# Altium schematic sheet balancing_protection.SchDoc
size A4; PageSetup: Record=PageOptions|CenterHorizontal=True|CenterVertical=True|PrintScale=1.00|XCorrection=1.00|YCorrection=1.00|PrintKind=0|BorderSize=5000000|LeftOffset=0|BottomOffset=0|Orientation=2|PaperLength=1000|PaperWidth=1000|Scale=100|PaperSource=7|PrintQuality=-4|MediaType=1|DitherType=10|PaperKind=A4|PrintScaleMode=1
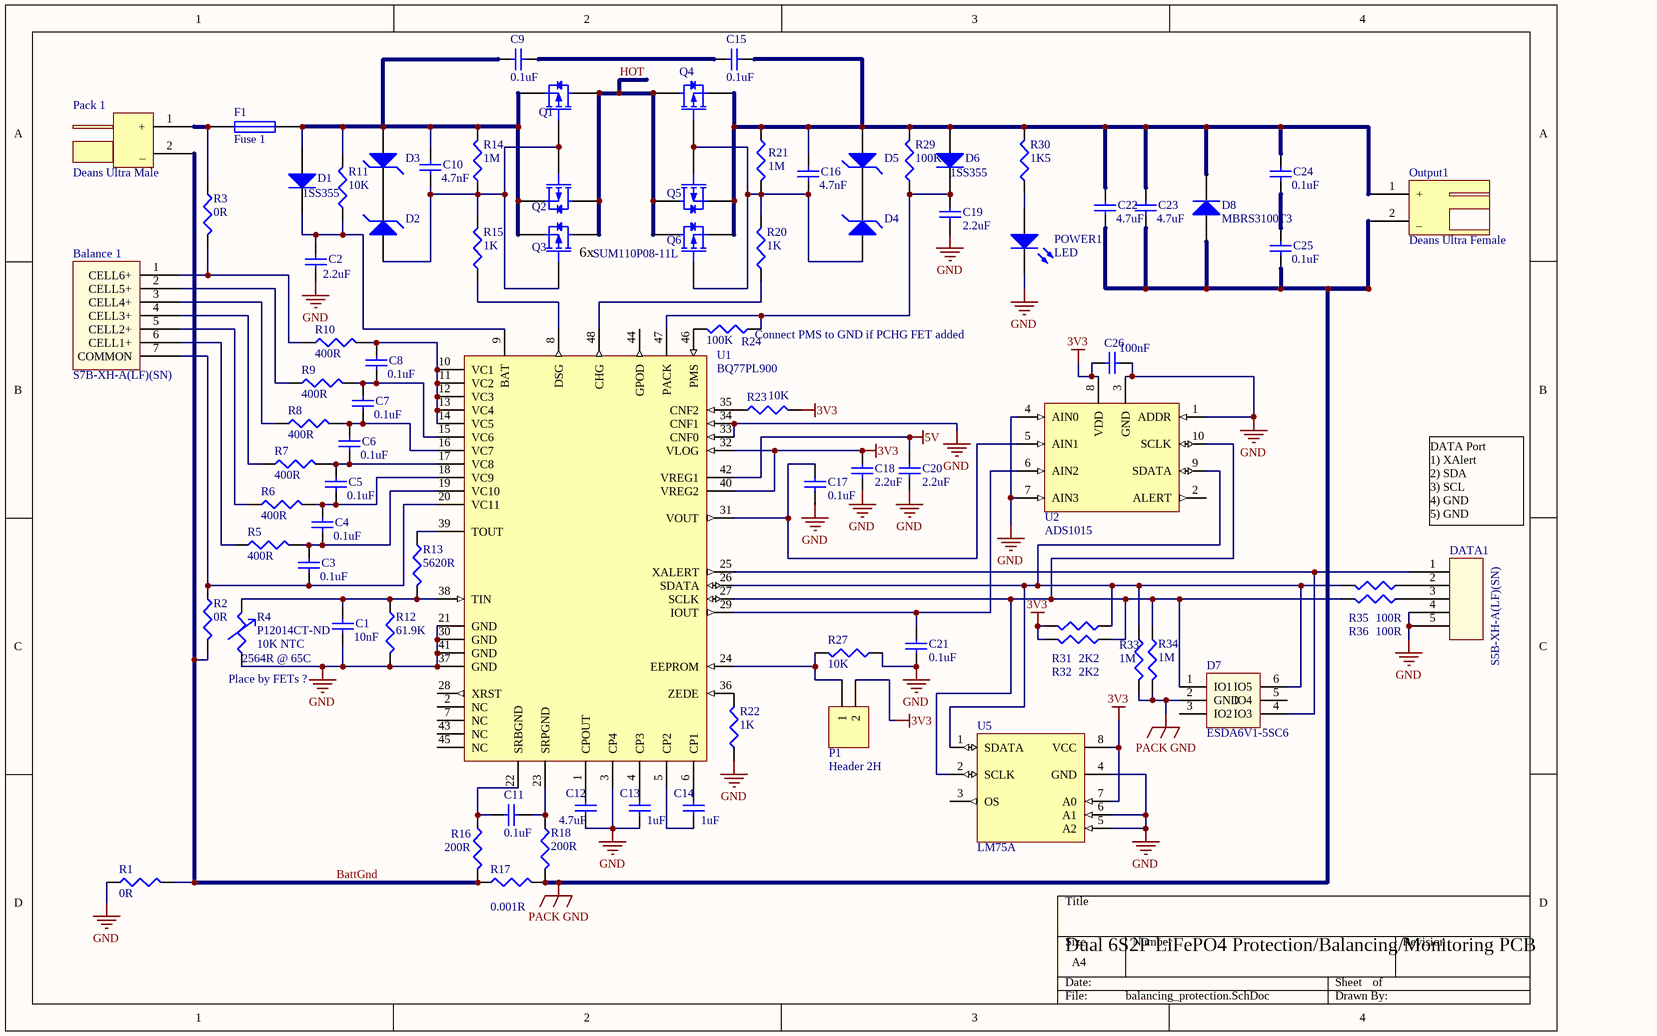
[diagram p0: balancing_protection.SchDoc]

## Parts
Balance_1  S7B-XH-A(LF)(SN)  [XH_BALANCE_CONN]
C1  value 10nF  [0603 - Hugo copy]  (hidden comment: Cap Semi)
C2  value 2.2uF  [CAPC1206X06N]  (hidden comment: 718-1113-1-ND)
C3  value 0.1uF  [0603 - Hugo copy]  (hidden comment: Cap Semi)
C4  value 0.1uF  [0603 - Hugo copy]  (hidden comment: Cap Semi)
C5  value 0.1uF  [0603 - Hugo copy]  (hidden comment: Cap Semi)
C6  value 0.1uF  [0603 - Hugo copy]  (hidden comment: Cap Semi)
C7  value 0.1uF  [0603 - Hugo copy]  (hidden comment: Cap Semi)
C8  value 0.1uF  [0603 - Hugo copy]  (hidden comment: Cap Semi)
C9  value 0.1uF  [0603 - Hugo copy]  (hidden comment: Cap Semi)
C10  value 4.7nF  [0603 - Hugo copy]  (hidden comment: Cap Semi)
C11  value 0.1uF  [0603 - Hugo copy]  (hidden comment: Cap Semi)
C12  value 4.7uF  [CAPC1210X10N]  (hidden comment: 718-1113-1-ND)
C13  value 1uF  [CAPC1206X06N]  (hidden comment: 718-1113-1-ND)
C14  value 1uF  [CAPC1206X06N]  (hidden comment: 718-1113-1-ND)
C15  value 0.1uF  [0603 - Hugo copy]  (hidden comment: Cap Semi)
C16  value 4.7nF  [0603 - Hugo copy]  (hidden comment: Cap Semi)
C17  value 0.1uF  [0603 - Hugo copy]  (hidden comment: 718-1113-1-ND)
C18  value 2.2uF  [0603 - Hugo copy]  (hidden comment: 718-1113-1-ND)
C19  value 2.2uF  [CAPC1206X06N]  (hidden comment: 718-1113-1-ND)
C20  value 2.2uF  [0603 - Hugo copy]  (hidden comment: 718-1113-1-ND)
C21  value 0.1uF  [0603 - Hugo copy]  (hidden comment: 718-1113-1-ND)
C22  value 4.7uF  [CAPC3216L]  (hidden comment: Cap Semi)
C23  value 4.7uF  [CAPC3216L]  (hidden comment: Cap Semi)
C24  value 0.1uF  [0603 - Hugo copy]  (hidden comment: Cap Semi)
C25  value 0.1uF  [0603 - Hugo copy]  (hidden comment: Cap Semi)
C26  value 100nF  [0603 - Hugo copy]  (hidden comment: Cap Semi)
D1  1SS355  [SOD323-rough]
D2  BZX585-C16  [SOD523-rough]  (value not drawn)
D3  BZX585-C16  [SOD523-rough]  (value not drawn)
D4  BZX585-C16  [SOD523-rough]  (value not drawn)
D5  BZX585-C16  [SOD523-rough]  (value not drawn)
D6  1SS355  [SOD323-rough]
D7  ESDA6V1-5SC6  [SOT23-6]
D8  MBRS3100T3  [SOJ300P790X241-2M-SMC Case 403]
DATA1  S5B-XH-A(LF)(SN)  [XH_I2C_CONN]
F1  Fuse 1  [FUSE outline]
Output1  Deans Ultra Female  [DEANS_FEMALE_SIDEWAYS - n]
P1  Header 2H  [HDR1X2H]
Pack_1  Deans Ultra Male  [DEANS_MALE_SIDEWAYS - n]
POWER1  LED  [LED0805]
Q1  SUM110P08-11L  [D2PAK]
Q2  SUM110P08-11L  [D2PAK]  (value not drawn)
Q3  SUM110P08-11L  [D2PAK]  (value not drawn)
Q4  SUM110P08-11L  [D2PAK]  (value not drawn)
Q5  SUM110P08-11L  [D2PAK]  (value not drawn)
Q6  SUM110P08-11L  [D2PAK]  (value not drawn)
R1  value 0R  [0603 - Hugo copy]  (hidden comment: 541-17.8ACCT-ND)
R2  value 0R  [0603 - Hugo Copy]  (hidden comment: 541-17.8ACCT-ND)
R3  value 0R  [0603 - Hugo Copy]  (hidden comment: 541-17.8ACCT-ND)
R4  P12014CT-ND  value 10K NTC  [0603 - Hugo copy]
R5  value 400R  [0603 - HUGO COPY]  (hidden comment: 541-17.8ACCT-ND)
R6  value 400R  [0603 - HUGO COPY]  (hidden comment: 541-17.8ACCT-ND)
R7  value 400R  [0603 - HUGO COPY]  (hidden comment: 541-17.8ACCT-ND)
R8  value 400R  [0603 - HUGO COPY]  (hidden comment: 541-17.8ACCT-ND)
R9  value 400R  [0603 - HUGO COPY]  (hidden comment: 541-17.8ACCT-ND)
R10  value 400R  [0603 - HUGO COPY]  (hidden comment: 541-17.8ACCT-ND)
R11  value 10K  [0603 - HUGO COPY]  (hidden comment: 541-17.8ACCT-ND)
R12  value 61.9K  [0603 - HUGO COPY]  (hidden comment: 541-17.8ACCT-ND)
R13  value 5620R  [0603 - HUGO COPY]  (hidden comment: 541-17.8ACCT-ND)
R14  value 1M  [0603 - HUGO COPY]  (hidden comment: Res3)
R15  value 1K  [0603 - HUGO COPY]  (hidden comment: Res3)
R16  value 200R  [0603 - HUGO COPY]  (hidden comment: 541-17.8ACCT-ND)
R17  value 0.001R  [RESC2512]  (hidden comment: PR2512FKG7W0R001L)
R18  value 200R  [0603 - HUGO COPY]  (hidden comment: 541-17.8ACCT-ND)
R20  value 1K  [0603 - HUGO COPY]  (hidden comment: Res3)
R21  value 1M  [0603 - HUGO COPY]  (hidden comment: Res3)
R22  value 1K  [0603 - HUGO COPY]  (hidden comment: 541-17.8ACCT-ND)
R23  value 10K  [0603 - HUGO COPY]  (hidden comment: 541-17.8ACCT-ND)
R24  value 100K  [0603 - HUGO COPY]  (hidden comment: 541-17.8ACCT-ND)
R27  value 10K  [0603 - HUGO COPY]  (hidden comment: 541-17.8ACCT-ND)
R29  value 100K  [0603 - HUGO COPY]  (hidden comment: 541-17.8ACCT-ND)
R30  value 1K5  [0603 - Hugo copy]  (hidden comment: Res3)
R31  value 2K2  [0603 - HUGO COPY]  (hidden comment: Res3)
R32  value 2K2  [0603 - HUGO COPY]  (hidden comment: Res3)
R33  value 1M  [0603 - HUGO COPY]  (hidden comment: 541-17.8ACCT-ND)
R34  value 1M  [0603 - HUGO COPY]  (hidden comment: 541-17.8ACCT-ND)
R35  value 100R  [0603 - HUGO COPY]  (hidden comment: Res3)
R36  value 100R  [0603 - HUGO COPY]  (hidden comment: Res3)
U1  BQ77PL900  [SOP63P1030X279-48N]
U2  ADS1015  [TSSOP50P490X110-10N]
U5  LM75A  [SOP127P600X175-8N]

## Nets
3V3: C18.2 C26.2 P1.2 R23.2 R31.2 R32.2 U1.32(VLOG) U1.40(VREG2) U2.8(VDD) U5.7(A0) U5.8(VCC)
5V: C20.2 U1.42(VREG1)
GND: C1.1 C2.1 C12.2 C13.2 C17.2 C18.1 C19.1 C20.1 C21.1 C26.1 DATA1.4 DATA1.5 POWER1.2(K) R1.1 R4.1 R12.2 R22.1 R27.1 U1.3(CP4) U1.21(GND) U1.30(GND) U1.33(CNF0) U1.34(CNF1) U1.37(GND) U1.41(GND) U2.1(ADDR) U2.3(GND) U2.4(AIN0) U2.7(AIN3) U5.4(GND) U5.5(A2) U5.6(A1)
PACK GND: C22.1 C23.1 C25.1 D7.2(GND) D8.1(A) Output1.2(_) R17.2 R18.2 R33.2 R34.2
BattGnd: Pack_1.2(_) R1.2 R2.2 R16.2 R17.1
HOT: Q1.1(D) Q2.1(D) Q3.1(D) Q4.1(D) Q5.1(D) Q6.1(D)
NetBalance_1_1: Balance_1.1(CELL6+) R3.2 R10.1
NetBalance_1_2: Balance_1.2(CELL5+) R9.1
NetBalance_1_3: Balance_1.3(CELL4+) R8.1
NetBalance_1_4: Balance_1.4(CELL3+) R7.1
NetBalance_1_5: Balance_1.5(CELL2+) R6.1
NetBalance_1_6: Balance_1.6(CELL1+) R5.1
NetBalance_1_7: Balance_1.7(COMMON) C3.1 R2.1 U1.20(VC11)
NetC1_2: C1.2 R4.2 R12.1 R13.2 U1.38(TIN)
NetC2_2: C2.2 D1.2(K) R11.1 U1.9(BAT)
NetC3_2: C3.2 C4.1 R5.2 U1.19(VC10)
NetC4_2: C4.2 C5.1 R6.2 U1.18(VC9)
NetC5_2: C5.2 C6.1 R7.2 U1.17(VC8)
NetC6_2: C6.2 C7.1 R8.2 U1.16(VC7)
NetC7_2: C7.2 C8.1 R9.2 U1.15(VC6)
NetC8_2: C8.2 R10.2 U1.10(VC1) U1.11(VC2) U1.12(VC3) U1.13(VC4) U1.14(VC5)
NetC9_1: C9.1 C15.2
NetC9_2: C9.2 C10.2 D1.1(A) D3.2(A) F1.1 Q1.3(S) Q2.3(S) Q3.3(S) R11.2 R14.2
NetC10_1: C10.1 D2.2(A) Q1.2(G) Q2.2(G) Q3.2(G) R14.1 R15.2
NetC11_1: C11.1 R16.1 U1.22(SRBGND)
NetC11_2: C11.2 R18.1 U1.23(SRPGND)
NetC12_1: C12.1 U1.1(CPOUT)
NetC13_1: C13.1 U1.4(CP3)
NetC14_1: C14.1 U1.6(CP1)
NetC14_2: C14.2 U1.5(CP2)
NetC15_1: C15.1 C16.2 C22.2 C23.2 C24.2 D5.2(A) D6.1(A) D8.2(K) Output1.1(+) Q4.3(S) Q5.3(S) Q6.3(S) R21.1 R29.2 R30.2
NetC16_1: C16.1 D4.2(A) Q4.2(G) Q5.2(G) Q6.2(G) R20.2 R21.2
NetC17_1: C17.1 U1.31(VOUT) U2.5(AIN1)
NetC19_2: C19.2 D6.2(K) R24.1 R29.1 U1.47(PACK)
NetC21_2: C21.2 U1.29(IOUT) U2.6(AIN2)
NetC24_1: C24.1 C25.2
NetD2_1: D2.1(K) D3.1(K)
NetD4_1: D4.1(K) D5.1(K)
NetD7_1: D7.1(IO1) R32.1 R34.1 R36.2 U1.27(SCLK) U2.10(SCLK) U5.2(SCLK)
NetD7_4: D7.4(IO3) DATA1.1 U1.25(XALERT)
NetD7_6: D7.6(IO5) R31.1 R33.1 R35.2 U1.26(SDATA) U2.9(SDATA) U5.1(SDATA)
NetDATA1_2: DATA1.2 R35.1
NetDATA1_3: DATA1.3 R36.1
NetF1_2: F1.2 Pack_1.1(+) R3.1
NetP1_1: P1.1 R27.2 U1.24(EEPROM)
NetPOWER1_1: POWER1.1(A) R30.1
NetR13_1: R13.1 U1.39(TOUT)
NetR15_1: R15.1 U1.8(DSG)
NetR20_1: R20.1 U1.48(CHG)
NetR22_2: R22.2 U1.36(ZEDE)
NetR23_1: R23.1 U1.35(CNF2)
NetR24_2: R24.2 U1.46(PMS)

Not connected (* = marked no-connect by the designer): D7 3(IO2) 5(IO4); U1 2(NC) 7(NC) 28(XRST) 43(NC) 44(GPOD) 45(NC); U2 2(ALERT); U5 3(OS)

## Notes on the sheet
- (near Q3) 6x
- (near R24) Connect PMS to GND if PCHG FET added
- DATA Port
  1) XAlert
  2) SDA
  3) SCL
  4) GND
  5) GND
- (near R4) Place by FETs ?
- (near R4) 2564R @ 65C
- Dual 6S2P LiFePO4 Protection/Balancing/Monitoring PCB

## Library data of the parts
Balance_1 = S7B-XH-A(LF)(SN): Balancing Connector 455-2240-ND
C1 C3-C11 C15 C16 C22-C26 = Cap Semi: Capacitor (Semiconductor SIM Model); Published: 8-Jun-2000; LatestRevisionDate: 29-May-2009; LatestRevisionNote: IPC-7351 Footprint Added.; PackageReference: C1206; Publisher: Altium Limited; PackageDescription: Chip Capacitor
C2 C12-C14 C17-C21 = TantCap1206: TANTAMOUNT® 293D series tantalum 1206 cap; Published: 8-Jun-2000; LatestRevisionDate: 17-Jul-2002; LatestRevisionNote: Re-released for DXP Platform.; PackageReference: C1206; Publisher: Altium Limited
D1 D6 = 1SS355: Diode, fast switch, 1SS355, 225mA; Published: 8-Jun-2000; LatestRevisionDate: 17-Jul-2002; LatestRevisionNote: Re-released for DXP Platform.; PackageVersion: Sep-1996; PackageReference: SMC; Publisher: Altium Limited; Code_JEDEC: DO-214-AB
D2-D5 = BZX585-C16: DIODE ZENER 16V 300MW SOD523; Published: 8-Jun-2000; LatestRevisionDate: 17-Jul-2002; LatestRevisionNote: Re-released for DXP Platform.; PackageDocument: Sep-1996; PackageReference: SMC; Publisher: Altium Limited; Code_JEDEC: DO-214-AB
D7 = TVS_ESDA6V1-5SC6: 5-signal ESD suppression TVS array; FarnellPartNumber: 1749270
D8 = MBRS3100T3: Diode, schottky, 3A, 100V; Published: 8-Jun-2000; LatestRevisionDate: 17-Jul-2002; LatestRevisionNote: Re-released for DXP Platform.; PackageVersion: Sep-1996; PackageReference: SMC; Publisher: Altium Limited; Code_JEDEC: DO-214-AB
DATA1 = S5B-XH-A(LF)(SN): Balancing Connector 455-2242-ND
F1 = Fuse 1: Keystone 3550-2 90 degree blade fuse holder; Published: 8-Jun-2000; LatestRevisionDate: 17-Jul-2002; LatestRevisionNote: Re-released for DXP Platform.; PackageReference: PIN-W2/E2.8; Publisher: Altium Limited
Output1 = DeansUltraFemale
P1 = Header 2H: Header, 2-Pin, Right Angle; LatestRevisionDate: 17-Jul-2002; LatestRevisionNote: Re-released for DXP Platform.; Publisher: Altium Limited
Pack_1 = DeansUltraMale
POWER1 = LED2: BLUE 0805 LED KP-2012MBC; Published: 8-Jun-2000; LatestRevisionDate: 17-Jul-2002; LatestRevisionNote: Re-released for DXP Platform.; PackageDocument: Feb-2002; PackageReference: 3.2X1.6X1.1; Publisher: Altium Limited
Q1-Q6 = SUM110P08-11L: P-Channel MOSFET - SUM110P08-11L; PackageDocument: 1995/1996; Published: 8-Jun-2000; LatestRevisionDate: 17-Jul-2002; LatestRevisionNote: Re-released for DXP Platform.; PackageReference: E3; Publisher: Altium Limited
R1 = 541-17.8ACCT-ND: Resistor 0R Ground Net Separation; Published: 8-Jun-2000; LatestRevisionDate: 04-Mar-2005; LatestRevisionNote: PCB Footprint replaced.; PackageReference: J1-0603; Publisher: Altium Limited
R2 R3 = 541-17.8ACCT-ND: Resistor 0R Net Separation; Published: 8-Jun-2000; LatestRevisionDate: 04-Mar-2005; LatestRevisionNote: PCB Footprint replaced.; PackageReference: J1-0603; Publisher: Altium Limited
R4 = P12014CT-ND: 10k NTC Thermistor 0603; Published: 8-Jun-2000; LatestRevisionDate: 04-Mar-2005; LatestRevisionNote: PCB Footprint replaced.; PackageReference: J1-0603; Publisher: Altium Limited
R5-R10 = 541-17.8ACCT-ND: Resistor 400R Balancing; Published: 8-Jun-2000; LatestRevisionDate: 04-Mar-2005; LatestRevisionNote: PCB Footprint replaced.; PackageReference: J1-0603; Publisher: Altium Limited
R11 = 541-17.8ACCT-ND: Resistor 10K C11 discharge (short circuit); Published: 8-Jun-2000; LatestRevisionDate: 04-Mar-2005; LatestRevisionNote: PCB Footprint replaced.; PackageReference: J1-0603; Publisher: Altium Limited
R12 = 541-17.8ACCT-ND: Resistor 61.9K Linearisation; Published: 8-Jun-2000; LatestRevisionDate: 04-Mar-2005; LatestRevisionNote: PCB Footprint replaced.; PackageReference: J1-0603; Publisher: Altium Limited
R13 = 541-17.8ACCT-ND: Resistor 5620R Thermistor potential divider; Published: 8-Jun-2000; LatestRevisionDate: 04-Mar-2005; LatestRevisionNote: PCB Footprint replaced.; PackageReference: J1-0603; Publisher: Altium Limited
R14 R21 = Res3: Resistor 1M FET gate protection?; Published: 8-Jun-2000; LatestRevisionDate: 04-Mar-2005; LatestRevisionNote: PCB Footprint replaced.; PackageReference: J1-0603; Publisher: Altium Limited
R15 R20 = Res3: Resistor 1K FET Gate drive resistor; Published: 8-Jun-2000; LatestRevisionDate: 04-Mar-2005; LatestRevisionNote: PCB Footprint replaced.; PackageReference: J1-0603; Publisher: Altium Limited
R16 R18 = 541-17.8ACCT-ND: Resistor 200R sense time const; Published: 8-Jun-2000; LatestRevisionDate: 04-Mar-2005; LatestRevisionNote: PCB Footprint replaced.; PackageReference: J1-0603; Publisher: Altium Limited
R17 = MCS3264R005FERCT-ND: Resistor 0.001R Sense; Published: 8-Jun-2000; LatestRevisionDate: 04-Mar-2005; LatestRevisionNote: PCB Footprint replaced.; PackageReference: J1-0603; Publisher: Altium Limited
R22 = 541-17.8ACCT-ND: Resistor 1K Pull Down; Published: 8-Jun-2000; LatestRevisionDate: 04-Mar-2005; LatestRevisionNote: PCB Footprint replaced.; PackageReference: J1-0603; Publisher: Altium Limited
R23 = 541-17.8ACCT-ND: Resistor 10K Pull up; Published: 8-Jun-2000; LatestRevisionDate: 04-Mar-2005; LatestRevisionNote: PCB Footprint replaced.; PackageReference: J1-0603; Publisher: Altium Limited
R24 = 541-17.8ACCT-ND: Resistor 100K Pre-charge mode select; Published: 8-Jun-2000; LatestRevisionDate: 04-Mar-2005; LatestRevisionNote: PCB Footprint replaced.; PackageReference: J1-0603; Publisher: Altium Limited
R27 = 541-17.8ACCT-ND: Resistor 10K Pull up/down; Published: 8-Jun-2000; LatestRevisionDate: 04-Mar-2005; LatestRevisionNote: PCB Footprint replaced.; PackageReference: J1-0603; Publisher: Altium Limited
R29 = 541-17.8ACCT-ND: Resistor 100K C19 discharge (short circuit); Published: 8-Jun-2000; LatestRevisionDate: 04-Mar-2005; LatestRevisionNote: PCB Footprint replaced.; PackageReference: J1-0603; Publisher: Altium Limited
R30 = Res3: Resistor 2.5K LED current limit CRCW06031K50FKEAHP; Published: 8-Jun-2000; LatestRevisionDate: 04-Mar-2005; LatestRevisionNote: PCB Footprint replaced.; PackageReference: J1-0603; Publisher: Altium Limited
R31 R32 = Res3: Resistor 4K7 I2C  pul-up; Published: 8-Jun-2000; LatestRevisionDate: 04-Mar-2005; LatestRevisionNote: PCB Footprint replaced.; PackageReference: J1-0603; Publisher: Altium Limited
R33 = 541-17.8ACCT-ND: Resistor 1M I2C pull down or protection?; Published: 8-Jun-2000; LatestRevisionDate: 04-Mar-2005; LatestRevisionNote: PCB Footprint replaced.; PackageReference: J1-0603; Publisher: Altium Limited
R34 = 541-17.8ACCT-ND: Resistor 17.8R Balancing; Published: 8-Jun-2000; LatestRevisionDate: 04-Mar-2005; LatestRevisionNote: PCB Footprint replaced.; PackageReference: J1-0603; Publisher: Altium Limited
R35 R36 = Res3: Resistor 100R I2C  protection; Published: 8-Jun-2000; LatestRevisionDate: 04-Mar-2005; LatestRevisionNote: PCB Footprint replaced.; PackageReference: J1-0603; Publisher: Altium Limited
U1 = BQ77PL900: Battery protector/AFE
U2 = ADS1015: Quad I/P I2C ADC
U5 = LM75A: Digital temperature sensor and thermal watchdog